# EAGLE design OttoPi10-RPi3A-HAT (EAGLE 9.6.2)
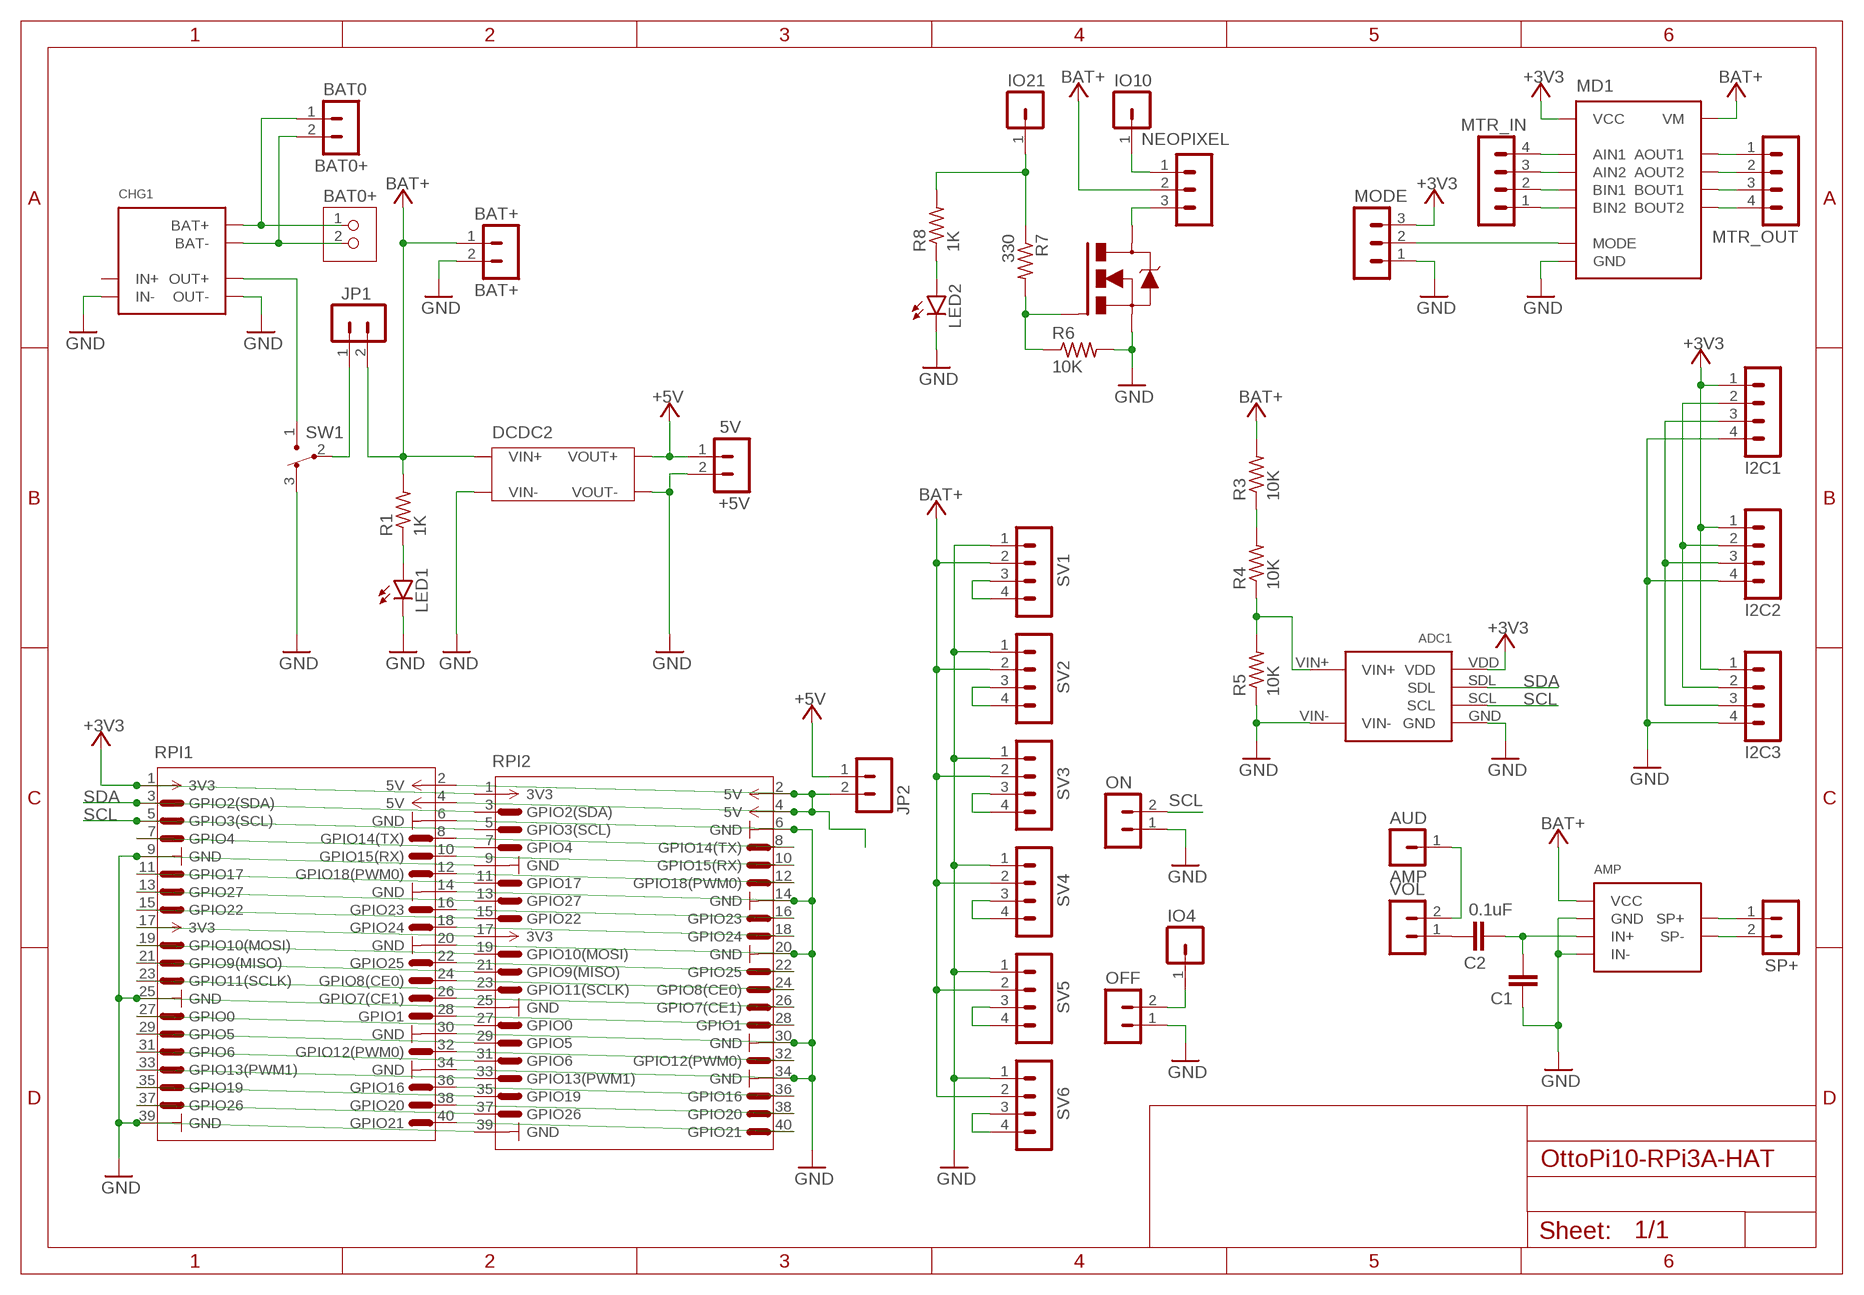
[diagram p0: schematic, sheet 1]

## Parts
+5V  5V  PINHEAD-MA02-1  [PINHEAD-MA02-1]
ADC1  MCP3425MOD  [MCP3425MOD]
AMP  AMP  PAM8012MOD  [PAM8012MOD-A]
AUD  AMP  PINHEAD-MA01-1  [PINHEAD-MA01-1]
BAT0  BAT0+  PINHEAD-MA02-1  [PINHEAD-MA02-1]
BAT0+  JST-PH2  [JST-PH2]
BAT+  BAT+  PINHEAD-MA02-1  [PINHEAD-MA02-1]
C1  C-EU025-024X044  [C025-024X044]
C2  0.1uF  C-EU025-024X044  [C025-024X044]
CHG1  TP4056MOD1  [TP4056MOD1]
DCDC2  DCDC-SX1308-MOD1  [DCDC-SX1308-MOD1]
I2C1  PINHEAD-MA04-1  [PINHEAD-MA04-1]
I2C2  PINHEAD-MA04-1  [PINHEAD-MA04-1]
I2C3  PINHEAD-MA04-1  [PINHEAD-MA04-1]
IO4  PINHEAD-MA01-1  [PINHEAD-MA01-1]
IO10  PINHEAD-MA01-1  [PINHEAD-MA01-1]
IO21  PINHEAD-MA01-1  [PINHEAD-MA01-1]
JP1  PINHEAD-MA02-1  [PINHEAD-MA02-1]
JP2  PINHEAD-MA02-1  [PINHEAD-MA02-1]
LED1  LED3MM  [LED3MM]
LED2  LED3MM  [LED3MM]
MD1  DRV8835MOD  [DRV8835MOD]
MODE  PINHEAD-MA03-1  [PINHEAD-MA03-1]
MTR_IN  PINHEAD-MA04-1  [PINHEAD-MA04-1]
MTR_OUT  PINHEAD-MA04-1  [PINHEAD-MA04-1]
NEOPIXEL  PINHEAD-MA03-1  [PINHEAD-MA03-1]
OFF  PINHEAD-MA02-1  [PINHEAD-MA02-1]
ON  PINHEAD-MA02-1  [PINHEAD-MA02-1]
Q1  2SK4017  MOSFET-2SK4017  [MOSFET-1]
R1  1K  R-US_0204/7  [0204/7]
R3  10K  R-US_0204/7  [0204/7]
R4  10K  R-US_0204/7  [0204/7]
R5  10K  R-US_0204/7  [0204/7]
R6  10K  R-US_0204/7  [0204/7]
R7  330  R-US_0204/7  [0204/7]
R8  1K  R-US_0204/7  [0204/7]
RPI1  RPI-PIN  [RPI-PIN]
RPI2  RPI-PIN  [RPI-PIN]
SP+  PINHEAD-MA02-1  [PINHEAD-MA02-1]
SV1  PINHEAD-MA04-1  [PINHEAD-MA04-1]
SV2  PINHEAD-MA04-1  [PINHEAD-MA04-1]
SV3  PINHEAD-MA04-1  [PINHEAD-MA04-1]
SV4  PINHEAD-MA04-1  [PINHEAD-MA04-1]
SV5  PINHEAD-MA04-1  [PINHEAD-MA04-1]
SV6  PINHEAD-MA04-1  [PINHEAD-MA04-1]
SW1  SW3-1  [SW3-1]
VOL  PINHEAD-MA02-1  [PINHEAD-MA02-1]

## Nets
+3V3: ADC1.VDD I2C1.1 I2C2.1 I2C3.1 MD1.VCC MODE.3 RPI1.1(3V3) RPI2.1(3V3)
+5V: +5V.1 DCDC2.VOUT+ JP2.1
+5V_RPI: JP2.2 RPI1.2(5V) RPI1.4(5V) RPI2.2(5V) RPI2.4(5V)
AIN1: MD1.AIN1 MTR_IN.4
AIN2: MD1.AIN2 MTR_IN.3
AOUT1: MD1.AOUT1 MTR_OUT.1
AOUT2: MD1.AOUT2 MTR_OUT.2
AUDIO0: AUD.1 VOL.2
AUDIO1: AMP.IN+ C1.2 C2.1
BAT+ [New Class]: AMP.V+(VCC) BAT+.1 DCDC2.VIN+ JP1.2 MD1.VM NEOPIXEL.2 R1.2 R3.2 SV1.2 SV2.2 SV3.2 SV4.2 SV5.2 SV6.2
BAT+0: BAT0+.1 BAT0.1 CHG1.BAT+
BAT+1: CHG1.OUT+ SW1.1
BAT+2: JP1.1 SW1.2
BAT-0: BAT0+.2 BAT0.2 CHG1.BAT-
BIN1: MD1.BIN1 MTR_IN.2
BIN2: MD1.BIN2 MTR_IN.1
BOUT1: MD1.BOUT1 MTR_OUT.3
BOUT2: MD1.BOUT2 MTR_OUT.4
GND: +5V.2 ADC1.GND ADC1.VIN- AMP.GND AMP.IN- BAT+.2 C1.1 CHG1.IN- CHG1.OUT- DCDC2.VIN- DCDC2.VOUT- I2C1.4 I2C2.4 I2C3.4 LED1.K(C) LED2.K(C) MD1.GND MODE.1 OFF.1 ON.1 Q1.S R5.1 R6.2 RPI1.6(GND) RPI1.9(GND) RPI1.14(GND) RPI1.20(GND) RPI1.25(GND) RPI1.30(GND) RPI1.34(GND) RPI1.39(GND) RPI2.6(GND) RPI2.9(GND) RPI2.14(GND) RPI2.20(GND) RPI2.25(GND) RPI2.30(GND) RPI2.34(GND) RPI2.39(GND) SV1.1 SV2.1 SV3.1 SV4.1 SV5.1 SV6.1 SW1.3
GPIO10: RPI1.17(3V3) RPI2.17(3V3)
MODE: MD1.MODE MODE.2
N$1: Q1.G R6.1 R7.2
N$2: NEOPIXEL.3 Q1.D
N$3: LED1.A R1.1
N$5: IO21.1 R7.1 R8.2
N$7: RPI1.7(GPIO4) RPI2.7(GPIO4)
N$8: IO10.1 NEOPIXEL.1
N$9: RPI1.11(GPIO17) RPI2.11(GPIO17)
N$10: RPI1.13(GPIO27) RPI2.13(GPIO27)
N$11: RPI1.15(GPIO22) RPI2.15(GPIO22)
N$12: RPI1.23(GPIO11(SCLK)) RPI2.23(GPIO11(SCLK))
N$13: RPI1.19(GPIO10(MOSI)) RPI2.19(GPIO10(MOSI))
N$14: RPI1.21(GPIO9(MISO)) RPI2.21(GPIO9(MISO))
N$15: C2.2 VOL.1
N$17: LED2.A R8.1
N$18: RPI1.8(GPIO14(TX)) RPI2.8(GPIO14(TX))
N$19: RPI1.10(GPIO15(RX)) RPI2.10(GPIO15(RX))
N$20: RPI1.12(GPIO18(PWM0)) RPI2.12(GPIO18(PWM0))
N$21: RPI1.16(GPIO23) RPI2.16(GPIO23)
N$22: RPI1.18(GPIO24) RPI2.18(GPIO24)
N$23: RPI1.22(GPIO25) RPI2.22(GPIO25)
N$24: IO4.1 OFF.2
N$25: R3.1 R4.2
N$26: ADC1.VIN+ R4.1 R5.2
N$27: RPI1.24(GPIO8(CE0)) RPI2.24(GPIO8(CE0))
N$28: RPI1.26(GPIO7(CE1)) RPI2.26(GPIO7(CE1))
N$29: RPI1.27(GPIO0) RPI2.27(GPIO0)
N$30: RPI1.28(GPIO1) RPI2.28(GPIO1)
N$31: RPI1.29(GPIO5) RPI2.29(GPIO5)
N$32: RPI1.31(GPIO6) RPI2.31(GPIO6)
N$33: RPI1.32(GPIO12(PWM0)) RPI2.32(GPIO12(PWM0))
N$34: RPI1.33(GPIO13(PWM1)) RPI2.33(GPIO13(PWM1))
N$35: RPI1.35(GPIO19) RPI2.35(GPIO19)
N$36: RPI1.36(GPIO16) RPI2.36(GPIO16)
N$37: RPI1.37(GPIO26) RPI2.37(GPIO26)
N$38: RPI1.38(GPIO20) RPI2.38(GPIO20)
N$39: RPI1.40(GPIO21) RPI2.40(GPIO21)
N$47: SV2.3 SV2.4
N$48: SV3.3 SV3.4
N$49: SV4.3 SV4.4
N$51: SV1.3 SV1.4
N$63: SV5.3 SV5.4
N$64: SV6.3 SV6.4
SCL: ADC1.SCL I2C1.3 I2C2.3 I2C3.3 ON.2 RPI1.5(GPIO3(SCL)) RPI2.5(GPIO3(SCL))
SDA: ADC1.SDL I2C1.2 I2C2.2 I2C3.2 RPI1.3(GPIO2(SDA)) RPI2.3(GPIO2(SDA))
SP+: AMP.SP+@1(SP+) SP+.1
SP-: AMP.SP-@1(SP-) SP+.2
Unconnected: CHG1.IN+

## Library data of the parts
+5V BAT0 BAT+ JP1 JP2 OFF ON SP+ VOL = ytani1:PINHEAD-MA02-1: PIN HEADER
ADC1 = ytani1:MCP3425MOD: MCP3425(16Bit ADC I2C 基準電圧内蔵)搭載モジュール; URL_AKIZUKI: https://akizukidenshi.com/catalog/g/gK-08018/
AMP = ytani1:PAM8012MOD: PAM8012使用2W D級アンプモジュール https://akizukidenshi.com/catalog/g/gK-08217/ Vin: 2.5V-5.5V 8ohm: 1W 4ohm: 2W IN-をGNDに接続することでシングルエンド入力としても使用できます。; CHIP1: PAM8012; OC_AKIZUKI: K-08217; URL_AKIZUKI: https://akizukidenshi.com/catalog/g/gK-08217/
AUD IO4 IO10 IO21 = ytani1:PINHEAD-MA01-1
BAT0+ = ytani1:JST-PH2
C1 C2 = rcl:C-EU: CAPACITOR, European symbol; SPICEPREFIX: C
CHG1 = ytani1:TP4056MOD1: LiPoバッテリー充電コントローラ(TP4056) https://www.amazon.co.jp/dp/B073J66H62/; URL_AMAZON: https://www.amazon.co.jp/dp/B073J66H62/
DCDC2 = ytani1:DCDC-SX1308-MOD1: DC/DC Step-Up converter MT3608 https://www.amazon.co.jp/gp/product/B095YKY29M/ SX1308 In 2V-24V Out 5V-28V = [VALUE] Max: 2A (1A recomended); AMAZON_URL: https://www.amazon.co.jp/gp/product/B095YKY29M/
I2C1-I2C3 MTR_IN MTR_OUT SV1-SV6 = ytani1:PINHEAD-MA04-1: PIN HEADER; OC_FARNELL: unknown; OC_NEWARK: unknown
LED1 LED2 = led:LED: LED OSRAM: - CHIPLED LG R971, LG N971, LY N971, LG Q971, LY Q971, LO R971, LY R971 LH N974, LH R974 LS Q976, LO Q976, LY Q976 LO Q996 - Hyper CHIPLED LW Q18S LB Q993, LB Q99A, LB R99A - SideLED LS A670, LO A670, LY A670, LG A670, LP A670 LB A673, LV A673, LT A673, LW A673 LH A674 LY A675 LS A676, LA A676, LO A676, LY A676, LW A676 LS A679, LY A679, LG A679 - Hyper Micro SIDELED® LS Y876, LA Y876, LO Y876, LY Y876 LT Y87S - SmartLED LW L88C, LW L88S LB L89C, LB L89S, LG L890 LS L89K, LO L89K, LY L89K LS L896, LA L896, LO L896, LY L896 - TOPLED LS T670, LO T670, LY T670, LG T670, LP T670 LSG T670, LSP T670, LSY T670, LOP T670, LYG T670 LG T671, LOG T671, LSG T671 LB T673, LV T673, LT T673, LW T673 LH T674 LS T676, LA T676, LO T676, LY T676, LB T676, LH T676, LSB T676, LW T676 LB T67C, LV T67C, LT T67C, LS T67K, LO T67K, LY T67K, LW E67C LS E67B, LA E67B, LO E67B, LY E67B, LB E67C, LV E67C, LT E67C LW T67C LS T679, LY T679, LG T679 LS T770, LO T770, LY T770, LG T770, LP T770 LB T773, LV T773, LT T773, LW T773 LH T774 LS E675, LA E675, LY E675, LS T675 LS T776, LA T776, LO T776, LY T776, LB T776 LHGB T686 LT T68C, LB T68C - Hyper Mini TOPLED® LB M676 - Mini TOPLED Santana® LG M470 LS M47K, LO M47K, LY M47K Source: http://www.osram.convergy.de LUXEON: - LUMILED® LXK2-PW12-R00, LXK2-PW12-S00, LXK2-PW14-U00, LXK2-PW14-V00 LXK2-PM12-R00, LXK2-PM12-S00, LXK2-PM14-U00 LXK2-PE12-Q00, LXK2-PE12-R00, LXK2-PE12-S00, LXK2-PE14-T00, LXK2-PE14-U00 LXK2-PB12-K00, LXK2-PB12-L00, LXK2-PB12-M00, LXK2-PB14-N00, LXK2-PB14-P00, LXK2-PB14-Q00 LXK2-PR12-L00, LXK2-PR12-M00, LXK2-PR14-Q00, LXK2-PR14-R00 LXK2-PD12-Q00, LXK2-PD12-R00, LXK2-PD12-S00 LXK2-PH12-R00, LXK2-PH12-S00 LXK2-PL12-P00, LXK2-PL12-Q00, LXK2-PL12-R00 Source: www.luxeon.com KINGBRIGHT: KA-3528ASYC Source: www.kingbright.com
MD1 = ytani1:DRV8835MOD: DRV8835 Motor Driver Module https://akizukidenshi.com/catalog/g/gK-09848/ Vcc = 2V-7V Vm = 0V-11V Iout = 0V-1.5A Fpwm = 0Hz-250kHz Vin = 0V-Vcc; OC_AKIZUKI: K-09848; URL_AKIZUKI: https://akizukidenshi.com/catalog/g/gK-09848/
MODE NEOPIXEL = ytani1:PINHEAD-MA03-1: PIN HEADER; OC_FARNELL: unknown; OC_NEWARK: unknown
Q1 = ytani1:MOSFET-2SK4017
R1 R3-R8 = rcl:R-US_: RESISTOR, American symbol; SPICEPREFIX: R
RPI1 RPI2 = ytani1:RPI-PIN: Raspberry Pi pin header
SW1 = ytani1:SW3-1: Slide Switch 3x1 pin https://www.amazon.co.jp/gp/product/B01LYVYQNO/ SS12D00G3 2ポジションSPDT 1P2T 3ピン; MF: HiLetgo; URL_AMAZON: https://www.amazon.co.jp/gp/product/B01LYVYQNO/

## Board
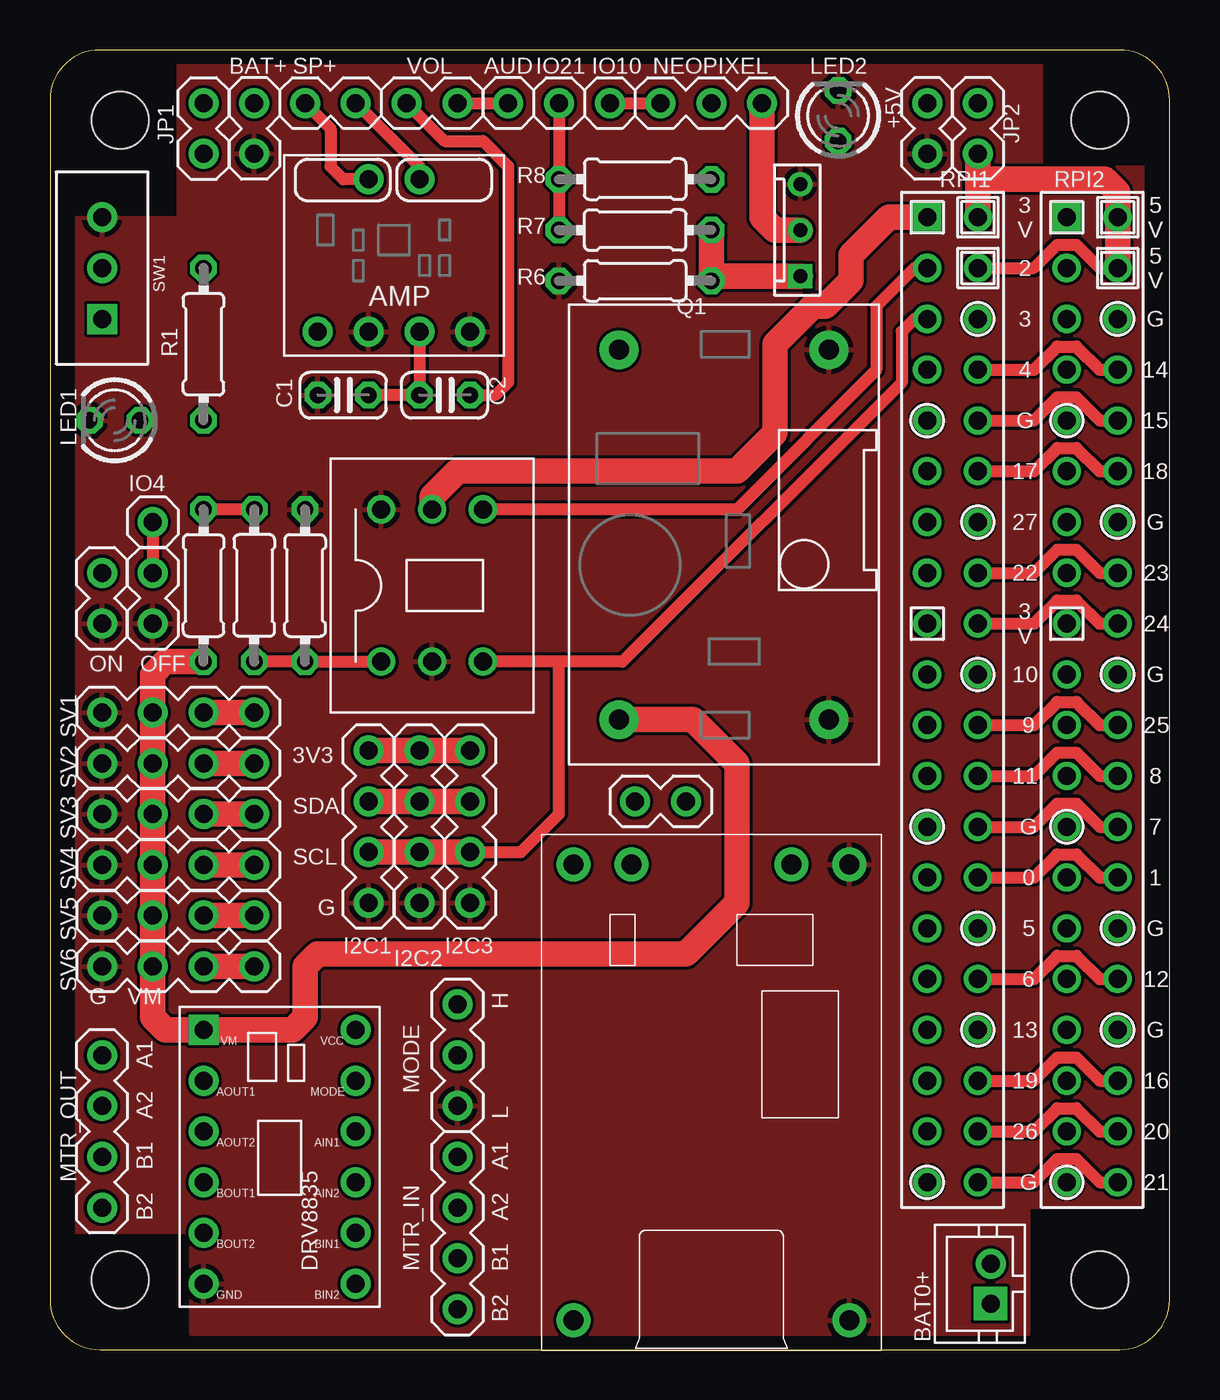
[diagram p1: board, top side]
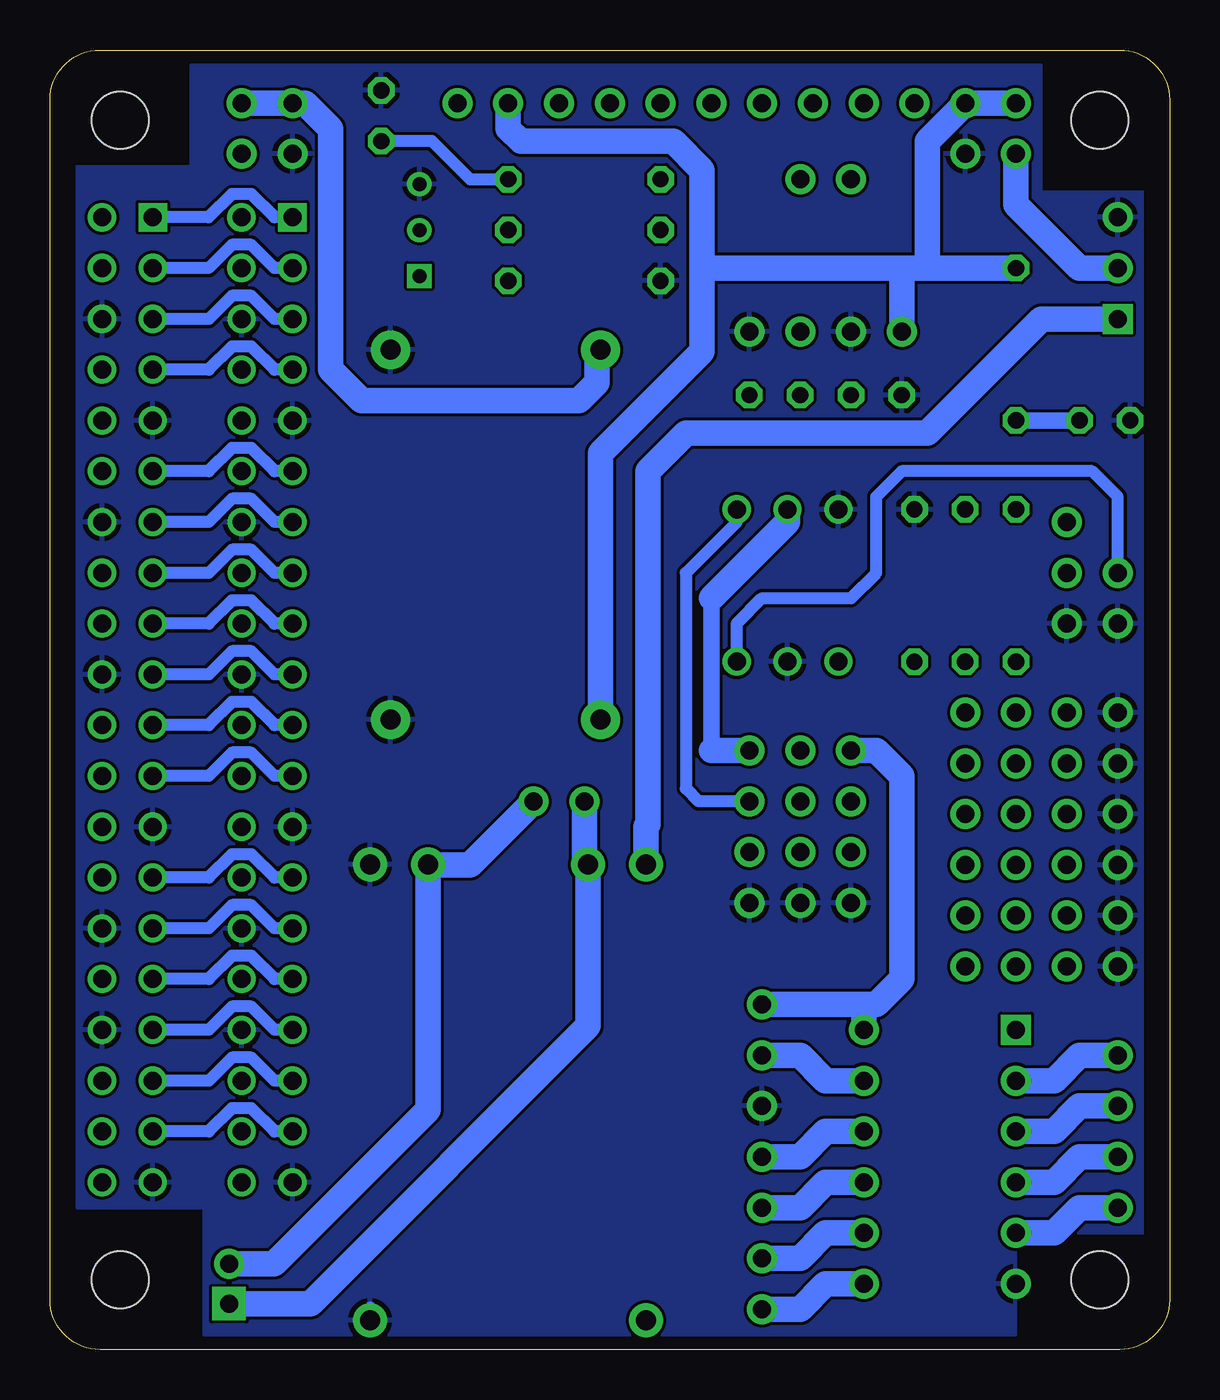
[diagram p2: board, bottom side, seen from below]

Size 56 x 65 mm. Coordinates in mm from the lower left corner, seen from the top.
Outline: 2.5,0 53.5,0 arc90 56,2.5 56,62.5 arc90 53.5,65 2.5,65 arc90 0,62.5 0,2.5 arc90 2.5,0
Copper layers (1*16): Top 0.035mm / dielectric 1.5mm / Bottom 0.035mm
Design rules "SeeedStudio_2layer_DRU_no_angle_20140221": minimum track width 6mil, minimum drill 12mil, track to track 6mil, track to pad 6mil, pad to pad 6mil, via to via 6mil, smd to smd 0mil, copper to edge 10mil, drill to drill 10mil, minimum pad ring 10mil, minimum via ring 6mil, stop-mask expansion 2mil, vias tented up to drill 100mil, thermal gap 10mil
Holes 2.85 mm at 52.5,3.5 52.5,61.5 3.5,61.5 3.5,3.5

### Footprints (pad centres in the part's own frame; a part is rotated, then mirrored left to right if it is on the bottom)
PINHEAD-MA02-1 = drill 0.9 pad 1.5: 1 -1.27,0; 2 1.27,0
MCP3425MOD = drill 0.9: GND -2.54,0; SCL -2.54,-2.54; SDL 5.08,-2.54; VDD 5.08,0; VIN+ -2.54,2.54; VIN- 5.08,2.54
PAM8012MOD-A = drill 0.9 pad 1.5: GND -3.81,1.27; IN+ -3.81,-1.27; IN- -3.81,-3.81; SP+@1 3.81,1.27; SP-@1 3.81,-1.27; V+ -3.81,3.81
PINHEAD-MA01-1 = drill 0.9 pad 1.5: 1 1.27,0
JST-PH2 = drill 0.9 pad 1.676 square: 1 -1,0 | drill 0.9 pad 1.5: 2 1,0
C025-024X044 = drill 0.813 octagon: 1 -1.27,0; 2 1.27,0
TP4056MOD1 = drill 1 pad 1.7: BAT+ 11.4,4; BAT- 11.4,-4; IN+ -11.4,6.9; IN- -11.4,-6.9; OUT+ 11.4,6.9; OUT- 11.4,-6.9
DCDC-SX1308-MOD1 = drill 1 pad 1.93: VIN+ -9.25,5.25; VIN- -9.25,-5.25; VOUT+ 9.25,5.25; VOUT- 9.25,-5.25
PINHEAD-MA04-1 = drill 0.9 pad 1.5: 1 -3.81,0; 2 -1.27,0; 3 1.27,0; 4 3.81,0
LED3MM = drill 0.813 octagon: A -1.27,0; K 1.27,0
DRV8835MOD = drill 0.9 pad 1.5: AIN1 5.08,5.08; AIN2 5.08,2.54; AOUT1 -2.54,7.62; AOUT2 -2.54,5.08; BIN1 5.08,0; BIN2 5.08,-2.54; BOUT1 -2.54,2.54; BOUT2 -2.54,0; GND -2.54,-2.54; MODE 5.08,7.62; VCC 5.08,10.16 | drill 0.9 pad 1.5 square: VM -2.54,10.16
PINHEAD-MA03-1 = drill 0.9 pad 1.5: 1 -1.27,0; 2 1.27,0; 3 3.81,0
MOSFET-1 = drill 0.7: D 1.27,0; S 3.57,0 | drill 0.7 square: G -1.03,0
0204/7 = drill 0.813 octagon: 1 -3.81,0; 2 3.81,0
RPI-PIN = drill 0.9 pad 1.422 square: 1 -1.27,24.13 | drill 0.9 pad 1.422: 2 1.27,24.13; 3 -1.27,21.59; 4 1.27,21.59 | drill 0.9: 5 -1.27,19.05; 6 1.27,19.05; 7 -1.27,16.51; 8 1.27,16.51; 9 -1.27,13.97; 10 1.27,13.97; 11 -1.27,11.43; 12 1.27,11.43; 13 -1.27,8.89; 14 1.27,8.89; 15 -1.27,6.35; 16 1.27,6.35; 17 -1.27,3.81; 18 1.27,3.81; 19 -1.27,1.27; 20 1.27,1.27; 21 -1.27,-1.27; 22 1.27,-1.27; 23 -1.27,-3.81; 24 1.27,-3.81; 25 -1.27,-6.35; 26 1.27,-6.35; 27 -1.27,-8.89; 28 1.27,-8.89; 29 -1.27,-11.43; 30 1.27,-11.43; 31 -1.27,-13.97; 32 1.27,-13.97; 33 -1.27,-16.51; 34 1.27,-16.51; 35 -1.27,-19.05; 36 1.27,-19.05; 37 -1.27,-21.59; 38 1.27,-21.59; 39 -1.27,-24.13; 40 1.27,-24.13
SW3-1 = drill 0.9 pad 1.5 square: 1 -1.27,0 | drill 0.9 pad 1.5: 2 1.27,0; 3 3.81,0

### Placement (x,y rotation side)
+5V  43.88,61.08 270 top
ADC1  19.11,36.95 90 top
AMP  17.2,54.73 90 top
AUD  22.92,63.61 270 top
BAT0  30.54,27.42 0 top
BAT0+  47.05,3.29 90 top
BAT+  10.22,61.08 270 top
C1  14.66,47.74 0 top
C2  19.74,47.74 0 top
CHG1  33.08,12.86 90 top
DCDC2  33.72,40.76 90 top
I2C1  15.94,26.15 270 top
I2C2  18.48,26.15 270 top
I2C3  21.02,26.15 270 top
IO4  3.87,41.39 0 top
IO10  26.73,62.34 0 top
IO21  24.19,62.34 0 top
JP1  7.68,61.08 90 top
JP2  46.41,61.08 270 top
LED1  3.23,46.47 180 top
LED2  39.43,61.71 90 top
MD1  10.22,5.83 0 top
MODE  20.38,13.45 90 top
MTR_IN  20.38,5.83 90 top
MTR_OUT  2.6,10.91 270 top
NEOPIXEL  31.81,62.34 0 top
OFF  5.14,37.58 90 top
ON  2.6,37.58 90 top
Q1  37.52,54.73 90 top
R1  7.68,50.28 90 top
R3  7.68,38.22 270 top
R4  10.22,38.22 90 top
R5  12.76,38.22 270 top
R6  29.27,53.45 180 top
R7  29.27,56 0 top
R8  29.27,58.53 180 top
RPI1  45.14,32.5 0 top
RPI2  52.13,32.5 0 top
SP+  14.03,62.34 0 top
SV1  6.41,31.86 0 top
SV2  6.41,29.32 0 top
SV3  6.41,26.79 0 top
SV4  6.41,24.24 0 top
SV5  6.41,21.7 0 top
SV6  6.41,19.16 0 top
SW1  2.6,52.82 90 top
VOL  19.11,62.34 0 top

### Tracks (layer width: path | path; a pad name or v marks a point on that pad's centre or on a via)
+3V3
  Top 1.27: I2C3.1 I2C2.1 I2C1.1 | ADC1.VDD 19.11,42.66 20.38,43.93 34.35,43.93 36.26,45.84 36.26,50.28 38.16,52.19 38.8,52.19 40.06,53.45 40.06,54.73 41.97,56.63 RPI1.1
  Bottom 0.61: RPI1.1 44.76,56.63 45.93,57.8 46.9,57.8 48.07,56.63 RPI2.1
  Bottom 0.813: 22.92,37.58 22.92,29.96
  Bottom 1.27: I2C1.1 14.66,29.96 13.39,28.69 13.39,18.53 14.66,17.26 15.3,17.26 | ADC1.VDD 19.11,41.39 22.92,37.58 | 22.92,29.96 I2C3.1 | MODE.3 15.3,17.26 | MD1.VCC 15.3,17.26
+5V
  Bottom 1.27: JP2.1 +5V.1 43.24,62.34 41.97,61.08 41.97,49.01 40.42,47.47 29.55,47.47 28.64,48.38 28.64,49.84 DCDC2.VOUT+
+5V_RPI
  Top 0.61: RPI1.4 49.21,54.09 50.38,55.26 51.34,55.26 52.51,54.09 RPI2.4
  Top 1.27: RPI1.2 46.41,58.53 | 46.41,58.53 52.77,58.53 53.4,57.9 RPI2.2 RPI2.4 | JP2.2 46.41,58.53
AIN1
  Bottom 1.27: MTR_IN.4 18.48,9.64 17.2,10.91 MD1.AIN1
AIN2
  Bottom 1.27: MTR_IN.3 18.48,7.1 17.2,8.37 MD1.AIN2
AOUT1
  Bottom 1.27: MD1.AOUT1 5.77,13.45 4.5,14.72 MTR_OUT.1
AOUT2
  Bottom 1.27: MD1.AOUT2 5.77,10.91 4.5,12.18 MTR_OUT.2
AUDIO0
  Top 0.61: VOL.2 AUD.1
AUDIO1
  Top 0.61: C1.2 C2.1 AMP.IN+
BAT+
  Top 1.27: R3.2 5.77,34.41 5.14,33.77 SV1.2 SV2.2 SV3.2 SV4.2 SV5.2 SV6.2 5.14,16.62 5.77,15.99 MD1.VM 12.12,15.99 12.76,16.62 12.76,19.16 13.39,19.8 31.81,19.8 34.35,22.34 34.35,29.32 32.17,31.5 DCDC2.VIN+
  Bottom 1.27: R1.2 12.12,54.09 | 12.12,54.09 13.39,54.09 | 13.39,54.09 AMP.V+ | 23.38,54.09 13.39,54.09 | 23.38,54.09 23.38,49.92 28.46,44.84 DCDC2.VIN+ | JP1.2 BAT+.1 12.12,60.44 12.12,54.09 | NEOPIXEL.2 33.08,61.08 32.45,60.44 24.82,60.44 23.38,59 23.38,54.09
BAT+0
  Bottom 1.27: BAT0+.1 42.97,2.29 29.08,16.18 CHG1.BAT+ 29.27,24.45 BAT0.1
BAT+1
  Bottom 1.27: CHG1.OUT+ 26.18,26.17 26.09,26.25 26.09,43.93 24.19,45.84 12.12,45.84 6.41,51.55 SW1.1
BAT+2
  Bottom 1.27: SW1.2 4.5,54.09 7.68,57.27 JP1.1
BAT-0
  Bottom 0.61: 37.06,24.24 CHG1.BAT-
  Bottom 1.27: BAT0.2 34.98,24.24 37.06,24.24 | CHG1.BAT- 37.08,11.99 44.78,4.29 BAT0+.2
BIN1
  Bottom 1.27: MTR_IN.2 18.48,4.56 17.2,5.83 MD1.BIN1
BIN2
  Bottom 1.27: MTR_IN.1 18.48,2.02 17.2,3.29 MD1.BIN2
BOUT1
  Bottom 1.27: MD1.BOUT1 5.77,8.37 4.5,9.64 MTR_OUT.3
BOUT2
  Bottom 1.27: MD1.BOUT2 5.77,5.83 4.5,7.1 MTR_OUT.4
GND
  Bottom 0.61: CHG1.IN- 39.98,2.1
  pour Bottom: 1.33,57.9 6.41,57.9 6.41,64.25 48.95,64.25 48.95,59.17 54.67,59.17 54.67,7.1 48.32,7.1 48.32,0.75 7.68,0.75 7.68,5.83 1.33,5.83
  pour Top: 1.33,56.63 6.41,56.63 6.41,64.25 49.59,64.25 49.59,59.17 54.67,59.17 54.67,7.1 48.95,7.1 48.95,0.75 7.05,0.75 7.05,5.83 1.33,5.83
GPIO10
  Bottom 0.61: RPI1.17 44.77,36.31 45.93,37.47 46.9,37.47 48.06,36.31 RPI2.17
MODE
  Bottom 1.27: MD1.MODE 17.2,13.45 18.48,14.72 MODE.2
N$1
  Top 1.27: R7.2 R6.1 33.32,53.7 Q1.G
N$2
  Top 1.27: NEOPIXEL.3 35.62,56.63 36.26,56 Q1.D
N$3
  Bottom 0.813: R1.1 LED1.A
N$5
  Top 0.61: IO21.1 R8.2 R7.1
N$7
  Bottom 0.61: RPI1.7 44.77,49.01 45.93,50.17 46.9,50.17 48.06,49.01 RPI2.7
N$8
  Top 0.61: IO10.1 NEOPIXEL.1
N$9
  Bottom 0.61: RPI1.11 44.77,43.93 45.93,45.09 46.9,45.09 48.06,43.93 RPI2.11
N$10
  Bottom 0.61: RPI1.13 44.77,41.39 45.93,42.55 46.9,42.55 48.06,41.39 RPI2.13
N$11
  Bottom 0.61: RPI1.15 44.77,38.85 45.93,40.01 46.9,40.01 48.06,38.85 RPI2.15
N$12
  Bottom 0.61: RPI1.23 44.77,28.69 45.93,29.85 46.9,29.85 48.06,28.69 RPI2.23
N$13
  Bottom 0.61: RPI1.19 44.77,33.77 45.93,34.93 46.9,34.93 48.06,33.77 RPI2.19
N$14
  Bottom 0.61: RPI1.21 44.77,31.23 45.93,32.39 46.9,32.39 48.06,31.23 RPI2.21
N$15
  Top 0.61: C2.2 22.29,47.74 22.92,48.38 22.92,59.17 21.65,60.44 19.74,60.44 VOL.1
N$17
  Bottom 0.61: R8.1 34.98,58.53 36.89,60.44 LED2.A
N$18
  Top 0.61: RPI1.8 49.22,49.01 50.38,50.17 51.34,50.17 52.5,49.01 RPI2.8
N$19
  Top 0.61: RPI1.10 49.22,46.47 50.38,47.63 51.34,47.63 52.5,46.47 RPI2.10
N$20
  Top 0.61: RPI1.12 49.22,43.93 50.38,45.09 51.34,45.09 52.5,43.93 RPI2.12
N$21
  Top 0.61: RPI1.16 49.22,38.85 50.38,40.01 51.34,40.01 52.5,38.85 RPI2.16
N$22
  Top 0.61: RPI1.18 49.22,36.31 50.38,37.47 51.34,37.47 52.5,36.31 RPI2.18
N$23
  Top 0.61: RPI1.22 49.22,31.23 50.38,32.39 51.34,32.39 52.5,31.23 RPI2.22
N$24
  Top 0.61: IO4.1 OFF.2
N$25
  Top 0.61: R4.2 R3.1
N$26
  Top 0.61: R4.1 R5.2 ADC1.VIN+
N$27
  Top 0.61: RPI1.24 49.22,28.69 50.38,29.85 51.34,29.85 52.5,28.69 RPI2.24
N$28
  Top 0.61: RPI1.26 49.22,26.15 50.38,27.31 51.34,27.31 52.5,26.15 RPI2.26
N$29
  Bottom 0.61: RPI1.27 44.77,23.61 45.93,24.77 46.9,24.77 48.06,23.61 RPI2.27
N$30
  Top 0.61: RPI1.28 49.22,23.61 50.38,24.77 51.34,24.77 52.5,23.61 RPI2.28
N$31
  Bottom 0.61: RPI1.29 44.77,21.07 45.93,22.23 46.9,22.23 48.06,21.07 RPI2.29
N$32
  Bottom 0.61: RPI1.31 44.77,18.53 45.93,19.69 46.9,19.69 48.06,18.53 RPI2.31
N$33
  Top 0.61: RPI1.32 49.22,18.53 50.38,19.69 51.34,19.69 52.5,18.53 RPI2.32
N$34
  Bottom 0.61: RPI1.33 44.77,15.99 45.93,17.15 46.9,17.15 48.06,15.99 RPI2.33
N$35
  Bottom 0.61: RPI1.35 44.77,13.45 45.93,14.61 46.9,14.61 48.06,13.45 RPI2.35
N$36
  Top 0.61: RPI1.36 49.22,13.45 50.38,14.61 51.34,14.61 52.5,13.45 RPI2.36
N$37
  Bottom 0.61: RPI1.37 44.77,10.91 45.93,12.07 46.9,12.07 48.06,10.91 RPI2.37
N$38
  Top 0.61: RPI1.38 49.22,10.91 50.38,12.07 51.34,12.07 52.5,10.91 RPI2.38
N$39
  Top 0.61: RPI1.40 49.22,8.37 50.38,9.53 51.34,9.53 52.5,8.37 RPI2.40
N$47
  Top 1.27: SV2.3 SV2.4
N$48
  Top 1.27: SV3.4 SV3.3
N$49
  Top 1.27: SV4.3 SV4.4
N$51
  Top 1.27: SV1.3 SV1.4
N$63
  Top 1.27: SV5.4 SV5.3
N$64
  Top 1.27: SV6.3 SV6.4
SCL
  Top 0.61: I2C3.3 23.55,24.88 25.46,26.79 25.46,34.41 | RPI1.5 43.24,51.55 42.61,50.91 42.61,48.38 28.64,34.41 25.46,34.41 | 25.46,34.41 ADC1.SCL
  Top 1.27: I2C3.3 I2C2.3 I2C1.3
  Bottom 0.61: RPI1.5 44.77,51.55 45.93,52.71 46.9,52.71 48.06,51.55 RPI2.5 | ADC1.SCL 21.65,36.31 20.38,37.58 15.94,37.58 14.66,38.85 14.66,42.66 13.39,43.93 3.87,43.93 2.6,42.66 ON.2
SDA
  Top 0.61: RPI1.3 43.24,54.09 41.34,52.19 41.34,49.01 34.35,42.02 ADC1.SDL
  Top 1.27: I2C1.2 I2C2.2 I2C3.2
  Bottom 0.61: RPI1.3 44.76,54.09 45.93,55.26 46.9,55.26 48.07,54.09 RPI2.3 | ADC1.SDL 21.65,41.39 24.19,38.85 24.19,28.05 23.55,27.42 I2C3.2
SP+
  Top 0.61: AMP.SP+@1 14.66,58.53 14.03,59.17 14.03,61.08 SP+.1
SP-
  Top 0.61: SP+.2 18.48,59.17 AMP.SP-@1

### Text on the board
tPlace: 3 / V | 5 / V | 2 | 5 / V | Q1 | 3 | G | 4 | 14 | G | 15 | 17 | 18 | 27 | G | 22 | 23 | 3 / V | 24 | 10 | G | 9 | 25 | 3V3 | 11 | 8 | SDA | G | 7 | SCL | 0 | 1 | G | 5 | G | 6 | 12 | G | VM | H | 13 | G | A1 | 19 | 16 | A2 | L | 26 | 20 | B1 | A1 | G | 21 | B2 | A2 | DRV8835 | B1 | B2